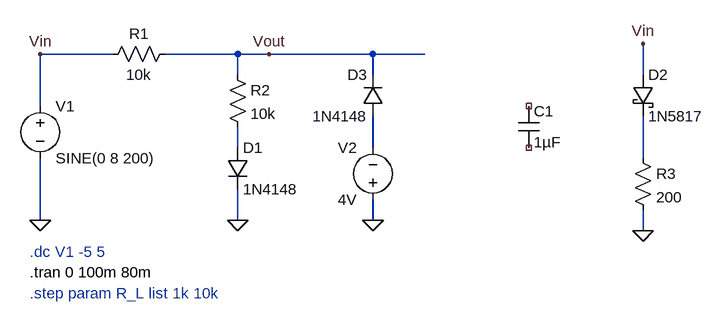
[diagram p0: schematic lab1part2q6.asc]
lab1part2q6.asc, the LTspice schematic file:
Version 4
SHEET 1 1096 680
WIRE 176 48 64 48
WIRE 368 48 256 48
WIRE 416 48 368 48
WIRE 576 48 416 48
WIRE 656 48 576 48
WIRE 368 80 368 48
WIRE 576 80 576 48
WIRE 992 80 992 32
WIRE 64 128 64 48
WIRE 368 192 368 160
WIRE 576 192 576 144
WIRE 992 208 992 144
WIRE 64 304 64 208
WIRE 368 304 368 256
WIRE 576 304 576 272
WIRE 992 320 992 288
FLAG 64 304 0
FLAG 64 48 Vin
FLAG 368 304 0
FLAG 992 32 Vin
FLAG 992 320 0
FLAG 416 48 Vout
FLAG 576 304 0
SYMBOL voltage 64 112 R0
WINDOW 123 0 0 Left 0
WINDOW 39 0 0 Left 0
SYMATTR InstName V1
SYMATTR Value SINE(0 8 200)
SYMBOL res 352 64 R0
SYMATTR InstName R2
SYMATTR Value 10k
SYMBOL diode 352 192 R0
SYMATTR InstName D1
SYMATTR Value 1N4148
SYMBOL res 976 192 R0
SYMATTR InstName R3
SYMATTR Value 200
SYMBOL schottky 976 80 R0
SYMATTR InstName D2
SYMATTR Value 1N5817
SYMATTR Description Diode
SYMATTR Type diode
SYMBOL cap 800 128 R0
SYMATTR InstName C1
SYMATTR Value 1µF
SYMBOL res 272 32 R90
WINDOW 0 0 56 VBottom 2
WINDOW 3 32 56 VTop 2
SYMATTR InstName R1
SYMATTR Value 10k
SYMBOL voltage 576 288 R180
WINDOW 0 24 96 Left 2
WINDOW 3 24 16 Left 2
WINDOW 123 0 0 Left 0
WINDOW 39 0 0 Left 0
SYMATTR InstName V2
SYMATTR Value 4V
SYMBOL diode 592 144 R180
WINDOW 0 24 64 Left 2
WINDOW 3 24 0 Left 2
SYMATTR InstName D3
SYMATTR Value 1N4148
TEXT 48 352 Left 2 ;.dc V1 -5 5
TEXT 48 384 Left 2 !.tran 0 100m 80m
TEXT 48 416 Left 2 ;.step param R_L list 1k 10k

The netlist it stands for:
* lab1part2q6.asc
V1 Vin 0 SINE(0 8 200)
R2 Vout N001 10k
D1 N001 0 1N4148
R3 N003 0 200
D2 Vin N003 1N5817
C1 NC_01 NC_02 1µF
R1 Vout Vin 10k
V2 0 N002 4V
D3 N002 Vout 1N4148
.model D D
.lib standard.dio
* .dc V1 -5 5
.tran 0 100m 80m
* .step param R_L list 1k 10k
.backanno
.end